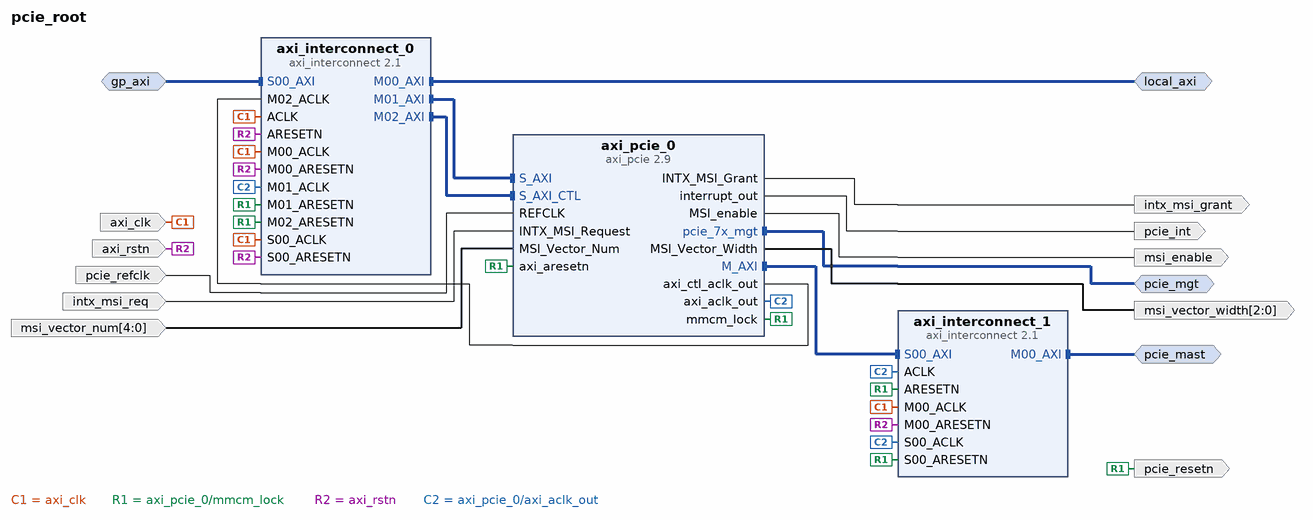
[diagram p0: block diagram of the top level]
# Vivado block design pcie_root, xc7z030fbg484-2, Vivado 2018.3
create_bd_design pcie_root

create_bd_intf_port -mode Master -vlnv xilinx.com:interface:aximm_rtl:1.0 local_axi
set_property -dict [list \
  CONFIG.DATA_WIDTH 32 \
  CONFIG.PROTOCOL AXI3 \
  CONFIG.FREQ_HZ 125000000 \
  CONFIG.ADDR_WIDTH 32 \
] [get_bd_intf_ports local_axi]
create_bd_intf_port -mode Slave -vlnv xilinx.com:interface:aximm_rtl:1.0 gp_axi
set_property -dict [list \
  CONFIG.DATA_WIDTH 32 \
  CONFIG.PROTOCOL AXI3 \
  CONFIG.FREQ_HZ 125000000 \
  CONFIG.ID_WIDTH 12 \
  CONFIG.ADDR_WIDTH 32 \
  CONFIG.AWUSER_WIDTH 0 \
  CONFIG.ARUSER_WIDTH 0 \
  CONFIG.WUSER_WIDTH 0 \
  CONFIG.RUSER_WIDTH 0 \
  CONFIG.BUSER_WIDTH 0 \
  CONFIG.READ_WRITE_MODE READ_WRITE \
  CONFIG.HAS_BURST 1 \
  CONFIG.HAS_LOCK 1 \
  CONFIG.HAS_PROT 1 \
  CONFIG.HAS_CACHE 1 \
  CONFIG.HAS_QOS 1 \
  CONFIG.HAS_REGION 1 \
  CONFIG.HAS_WSTRB 1 \
  CONFIG.HAS_BRESP 1 \
  CONFIG.HAS_RRESP 1 \
  CONFIG.SUPPORTS_NARROW_BURST 1 \
  CONFIG.NUM_READ_OUTSTANDING 8 \
  CONFIG.NUM_WRITE_OUTSTANDING 8 \
  CONFIG.MAX_BURST_LENGTH 16 \
  CONFIG.NUM_READ_THREADS 1 \
  CONFIG.NUM_WRITE_THREADS 1 \
  CONFIG.RUSER_BITS_PER_BYTE 0 \
  CONFIG.WUSER_BITS_PER_BYTE 0 \
] [get_bd_intf_ports gp_axi]
create_bd_intf_port -mode Master -vlnv xilinx.com:interface:aximm_rtl:1.0 pcie_mast
set_property -dict [list \
  CONFIG.DATA_WIDTH 64 \
  CONFIG.PROTOCOL AXI3 \
  CONFIG.FREQ_HZ 125000000 \
  CONFIG.ADDR_WIDTH 32 \
  CONFIG.HAS_BURST 1 \
  CONFIG.HAS_QOS 1 \
  CONFIG.HAS_REGION 1 \
  CONFIG.NUM_READ_OUTSTANDING 1 \
  CONFIG.NUM_WRITE_OUTSTANDING 1 \
] [get_bd_intf_ports pcie_mast]
create_bd_intf_port -mode Master -vlnv xilinx.com:interface:pcie_7x_mgt_rtl:1.0 pcie_mgt
create_bd_port -dir I -type clk axi_clk
set_property -dict {CONFIG.FREQ_HZ 125000000 CONFIG.ASSOCIATED_RESET axi_rstn} [get_bd_ports axi_clk]
create_bd_port -dir O pcie_resetn
create_bd_port -dir I -type rst axi_rstn
set_property -dict {CONFIG.POLARITY ACTIVE_LOW} [get_bd_ports axi_rstn]
create_bd_port -dir O -type intr pcie_int
create_bd_port -dir I -type clk pcie_refclk
set_property -dict {CONFIG.FREQ_HZ 100000000} [get_bd_ports pcie_refclk]
create_bd_port -dir I intx_msi_req
create_bd_port -dir I -from 4 -to 0 msi_vector_num
create_bd_port -dir O intx_msi_grant
create_bd_port -dir O msi_enable
create_bd_port -dir O -from 2 -to 0 msi_vector_width

create_bd_cell -type ip -vlnv xilinx.com:ip:axi_interconnect:2.1 axi_interconnect_0
set_property -dict [list \
  CONFIG.NUM_MI 3 \
  CONFIG.ENABLE_ADVANCED_OPTIONS 0 \
  CONFIG.ENABLE_PROTOCOL_CHECKERS 0 \
  CONFIG.M00_HAS_DATA_FIFO 0 \
  CONFIG.M01_HAS_DATA_FIFO 0 \
  CONFIG.M02_HAS_DATA_FIFO 0 \
  CONFIG.S00_HAS_DATA_FIFO 0 \
] [get_bd_cells axi_interconnect_0]
create_bd_cell -type ip -vlnv xilinx.com:ip:axi_interconnect:2.1 axi_interconnect_1
set_property -dict [list \
  CONFIG.NUM_MI 1 \
  CONFIG.ENABLE_ADVANCED_OPTIONS 0 \
  CONFIG.ENABLE_PROTOCOL_CHECKERS 1 \
  CONFIG.XBAR_DATA_WIDTH 64 \
  CONFIG.S00_HAS_DATA_FIFO 0 \
] [get_bd_cells axi_interconnect_1]
create_bd_cell -type ip -vlnv xilinx.com:ip:axi_pcie:2.9 axi_pcie_0
set_property -dict [list \
  CONFIG.INCLUDE_RC Root_Port_of_PCI_Express_Root_Complex \
  CONFIG.VENDOR_ID 0x1A4A \
  CONFIG.DEVICE_ID 0x3001 \
  CONFIG.ENABLE_CLASS_CODE false \
  CONFIG.CLASS_CODE 0x060400 \
  CONFIG.BASE_CLASS_MENU Bridge_device \
  CONFIG.SUB_CLASS_INTERFACE_MENU PCI_to_PCI_bridge \
  CONFIG.BAR0_SCALE Gigabytes \
  CONFIG.BAR0_SIZE 1 \
  CONFIG.NUM_MSI_REQ 5 \
  CONFIG.COMP_TIMEOUT 50ms \
  CONFIG.AXIBAR_AS_0 true \
  CONFIG.AXIBAR2PCIEBAR_0 0xb0000000 \
  CONFIG.BASEADDR 0x00000000 \
  CONFIG.HIGHADDR 0x001FFFFF \
  CONFIG.S_AXI_DATA_WIDTH 64 \
  CONFIG.M_AXI_DATA_WIDTH 64 \
  CONFIG.BAR_64BIT true \
  CONFIG.shared_logic_in_core true \
  CONFIG.en_ext_pipe_interface false \
  CONFIG.rp_bar_hide true \
  CONFIG.enable_jtag_dbg false \
] [get_bd_cells axi_pcie_0]

# ---- connections ----

connect_bd_intf_net [get_bd_intf_pins axi_interconnect_0/M01_AXI] [get_bd_intf_pins axi_pcie_0/S_AXI]
connect_bd_intf_net [get_bd_intf_pins axi_interconnect_0/M02_AXI] [get_bd_intf_pins axi_pcie_0/S_AXI_CTL]
connect_bd_intf_net [get_bd_intf_pins axi_interconnect_1/S00_AXI] [get_bd_intf_pins axi_pcie_0/M_AXI]
connect_bd_intf_net [get_bd_intf_ports local_axi] [get_bd_intf_pins axi_interconnect_0/M00_AXI]
connect_bd_intf_net [get_bd_intf_ports gp_axi] [get_bd_intf_pins axi_interconnect_0/S00_AXI]
connect_bd_intf_net [get_bd_intf_ports pcie_mast] [get_bd_intf_pins axi_interconnect_1/M00_AXI]
connect_bd_intf_net [get_bd_intf_ports pcie_mgt] [get_bd_intf_pins axi_pcie_0/pcie_7x_mgt]
connect_bd_net [get_bd_ports axi_clk] \
  [get_bd_pins axi_interconnect_0/ACLK] [get_bd_pins axi_interconnect_0/S00_ACLK] [get_bd_pins axi_interconnect_0/M00_ACLK] \
  [get_bd_pins axi_interconnect_1/M00_ACLK]
connect_bd_net [get_bd_pins axi_pcie_0/mmcm_lock] \
  [get_bd_ports pcie_resetn] [get_bd_pins axi_pcie_0/axi_aresetn] [get_bd_pins axi_interconnect_0/M01_ARESETN] \
  [get_bd_pins axi_interconnect_0/M02_ARESETN] [get_bd_pins axi_interconnect_1/ARESETN] \
  [get_bd_pins axi_interconnect_1/S00_ARESETN]
connect_bd_net [get_bd_ports axi_rstn] \
  [get_bd_pins axi_interconnect_0/ARESETN] [get_bd_pins axi_interconnect_0/S00_ARESETN] \
  [get_bd_pins axi_interconnect_0/M00_ARESETN] [get_bd_pins axi_interconnect_1/M00_ARESETN]
connect_bd_net [get_bd_pins axi_pcie_0/interrupt_out] [get_bd_ports pcie_int]
connect_bd_net [get_bd_ports pcie_refclk] [get_bd_pins axi_pcie_0/REFCLK]
connect_bd_net [get_bd_ports intx_msi_req] [get_bd_pins axi_pcie_0/INTX_MSI_Request]
connect_bd_net [get_bd_ports msi_vector_num] [get_bd_pins axi_pcie_0/MSI_Vector_Num]
connect_bd_net [get_bd_pins axi_pcie_0/INTX_MSI_Grant] [get_bd_ports intx_msi_grant]
connect_bd_net [get_bd_pins axi_pcie_0/MSI_enable] [get_bd_ports msi_enable]
connect_bd_net [get_bd_pins axi_pcie_0/MSI_Vector_Width] [get_bd_ports msi_vector_width]
connect_bd_net -net M02_ACLK_1 [get_bd_pins axi_pcie_0/axi_ctl_aclk_out] [get_bd_pins axi_interconnect_0/M02_ACLK]
connect_bd_net [get_bd_pins axi_pcie_0/axi_aclk_out] \
  [get_bd_pins axi_interconnect_0/M01_ACLK] [get_bd_pins axi_interconnect_1/S00_ACLK] [get_bd_pins axi_interconnect_1/ACLK]

# ---- address map ----
assign_bd_address -offset 0x00000000 -range 4G -target_address_space [get_bd_addr_spaces axi_pcie_0/M_AXI] [get_bd_addr_segs pcie_mast/Reg]
assign_bd_address -offset 0x80000000 -range 512M -target_address_space [get_bd_addr_spaces gp_axi] [get_bd_addr_segs local_axi/Reg]
assign_bd_address -offset 0xA0000000 -range 256M -target_address_space [get_bd_addr_spaces gp_axi] [get_bd_addr_segs axi_pcie_0/S_AXI_CTL/CTL0]
assign_bd_address -offset 0xB0000000 -range 256M -target_address_space [get_bd_addr_spaces gp_axi] [get_bd_addr_segs axi_pcie_0/S_AXI/BAR0]

validate_bd_design
save_bd_design
